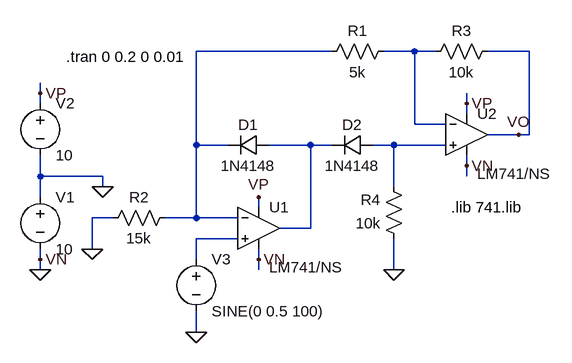
[diagram p0: schematic eje2.asc]
eje2.asc, the LTspice schematic file:
Version 4
SHEET 1 880 680
WIRE 304 -16 96 -16
WIRE 432 -16 384 -16
WIRE 464 -16 432 -16
WIRE 608 -16 544 -16
WIRE -144 48 -144 32
WIRE -144 64 -144 48
WIRE 512 64 512 48
WIRE 512 80 512 64
WIRE 432 96 432 -16
WIRE 480 96 432 96
WIRE 592 112 544 112
WIRE 608 112 608 -16
WIRE 608 112 592 112
WIRE 96 128 96 -16
WIRE 144 128 96 128
WIRE 272 128 208 128
WIRE 304 128 272 128
WIRE 400 128 368 128
WIRE 480 128 400 128
WIRE 512 160 512 144
WIRE -144 176 -144 144
WIRE -48 176 -144 176
WIRE 512 176 512 160
WIRE -48 192 -48 176
WIRE 400 192 400 128
WIRE -144 208 -144 176
WIRE 192 224 192 208
WIRE -32 240 -64 240
WIRE 96 240 96 128
WIRE 96 240 48 240
WIRE 160 240 96 240
WIRE 272 256 272 128
WIRE 272 256 224 256
WIRE 160 272 96 272
WIRE -64 288 -64 240
WIRE -144 304 -144 288
WIRE 96 304 96 272
WIRE 192 304 192 288
WIRE -144 320 -144 304
WIRE 192 320 192 304
WIRE 400 320 400 272
WIRE 96 416 96 384
FLAG -144 320 0
FLAG 400 320 0
FLAG -144 48 VP
FLAG -48 192 0
FLAG 96 416 0
FLAG -144 304 VN
FLAG -64 288 0
FLAG 592 112 VO
FLAG 192 208 VP
FLAG 192 304 VN
FLAG 512 64 VP
FLAG 512 160 VN
SYMBOL diode 208 112 R90
WINDOW 0 0 32 VBottom 2
WINDOW 3 32 32 VTop 2
SYMATTR InstName D1
SYMATTR Value 1N4148
SYMBOL diode 368 112 R90
WINDOW 0 0 32 VBottom 2
WINDOW 3 32 32 VTop 2
SYMATTR InstName D2
SYMATTR Value 1N4148
SYMBOL res 400 -32 R90
WINDOW 0 0 56 VBottom 2
WINDOW 3 32 56 VTop 2
SYMATTR InstName R1
SYMATTR Value 5k
SYMBOL res 64 224 R90
WINDOW 0 0 56 VBottom 2
WINDOW 3 32 56 VTop 2
SYMATTR InstName R2
SYMATTR Value 15k
SYMBOL res 560 -32 R90
WINDOW 0 0 56 VBottom 2
WINDOW 3 32 56 VTop 2
SYMATTR InstName R3
SYMATTR Value 10k
SYMBOL res 416 288 R180
WINDOW 0 36 76 Left 2
WINDOW 3 36 40 Left 2
SYMATTR InstName R4
SYMATTR Value 10k
SYMBOL voltage -144 192 R0
WINDOW 123 0 0 Left 0
WINDOW 39 0 0 Left 0
SYMATTR InstName V1
SYMATTR Value 10
SYMBOL voltage -144 48 R0
WINDOW 123 0 0 Left 0
WINDOW 39 0 0 Left 0
SYMATTR InstName V2
SYMATTR Value 10
SYMBOL voltage 96 288 R0
WINDOW 123 0 0 Left 0
WINDOW 39 0 0 Left 0
SYMATTR InstName V3
SYMATTR Value SINE(0 0.5 100)
SYMBOL OpAmps\\opamp2 192 192 R0
WINDOW 3 16 96 Invisible 2
WINDOW 38 16 124 Left 2
SYMATTR InstName U1
SYMATTR Value LM741/NS
SYMATTR SpiceModel LM741/NS
SYMBOL OpAmps\\opamp2 512 48 R0
WINDOW 3 16 96 Invisible 2
WINDOW 38 16 124 Left 2
SYMATTR InstName U2
SYMATTR Value LM741/NS
SYMATTR SpiceModel LM741/NS
TEXT -104 -8 Left 2 !.tran 0 0.2 0 0.01
TEXT 488 224 Left 2 !.lib 741.lib

The netlist it stands for:
* eje2.asc
D1 N003 N001 1N4148
D2 N004 N003 1N4148
R1 N002 N001 5k
R2 N001 0 15k
R3 VO N002 10k
R4 0 N004 10k
V1 0 0 10
V2 VP 0 10
V3 N005 0 SINE(0 0.5 100)
XU1 N005 N001 VP 0 N003 LM741/NS LM741/NS  ; pins In+ In- V+ V- OUT
XU2 N004 N002 VP 0 VO LM741/NS LM741/NS  ; pins In+ In- V+ V- OUT
.model D D
.lib standard.dio
.tran 0 0.2 0 0.01
.lib 741.lib
.backanno
.end